# Altium schematic sheet Power.SchDoc
size A4; SheetNumber: 4; SheetTotal: 9
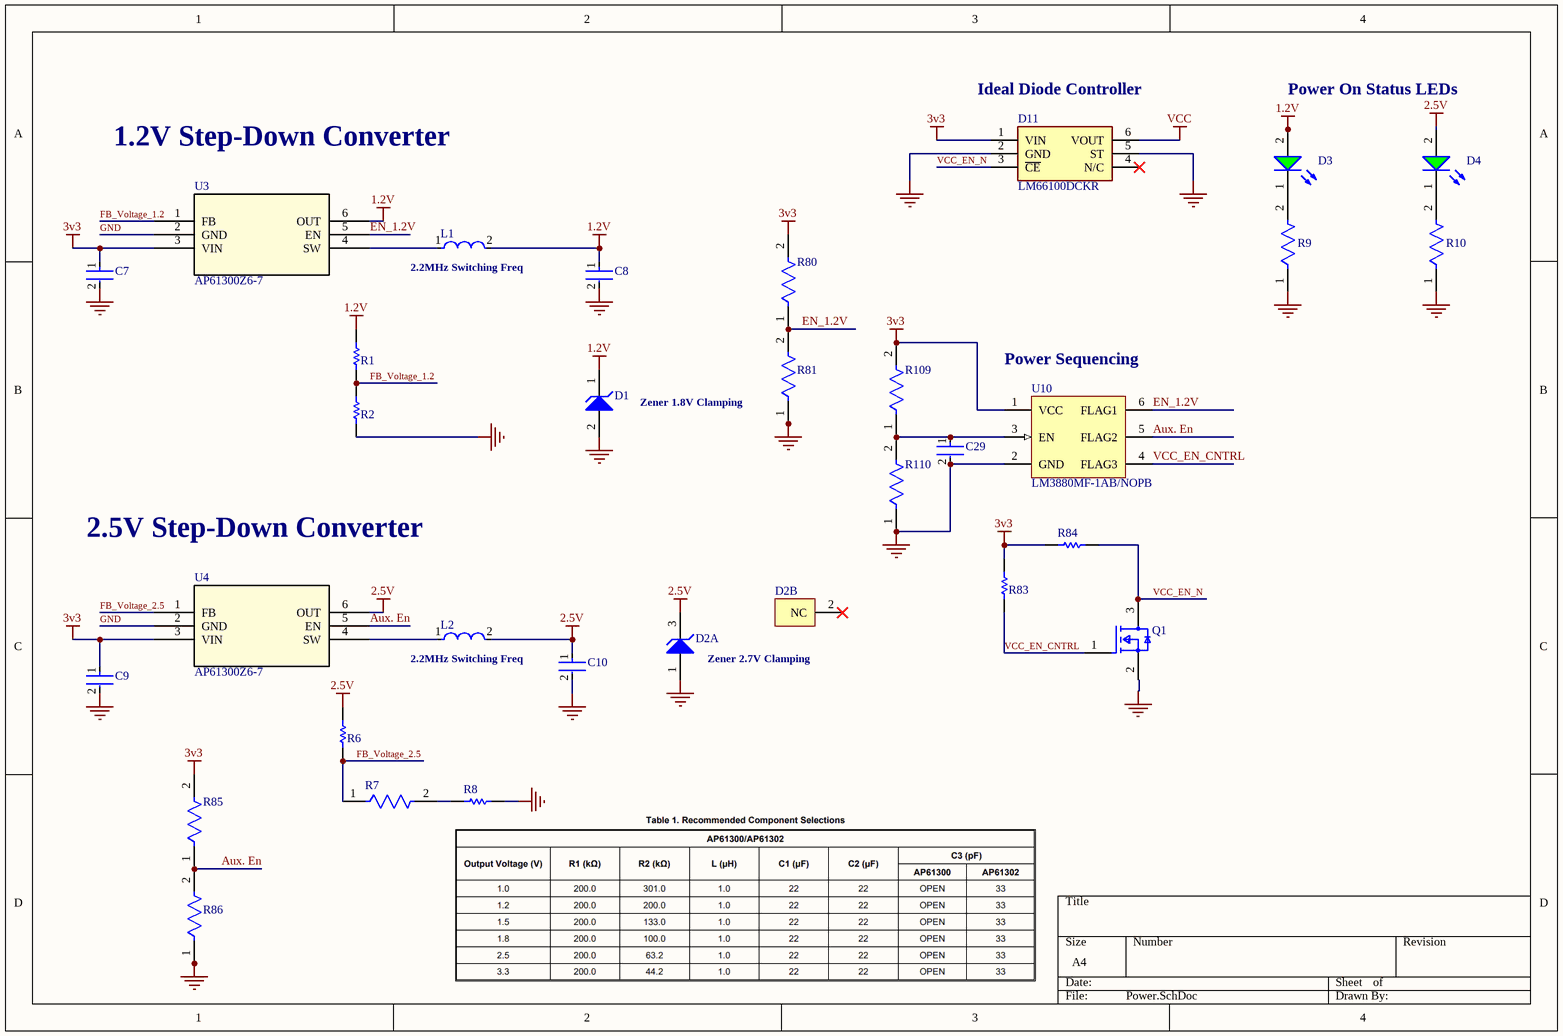
[diagram p0: Power.SchDoc]

## Parts
C7  GRT21BR61E226ME13L  [FP-GRT21B-0_2-IPC_C]  (value not drawn)
C8  GRT21BR61E226ME13L  [FP-GRT21B-0_2-IPC_C]  (value not drawn)
C9  GRT21BR61E226ME13L  [FP-GRT21B-0_2-IPC_C]  (value not drawn)
C10  GRT21BR61E226ME13L  [FP-GRT21B-0_2-IPC_C]  (value not drawn)
C29  CC0402KRX7R7BB104  [FP-CC0402-MFG]  (value not drawn)
D1  SZMMSZ4678T1G  [ONSC-SOD-123-2-425-04_V]  (value not drawn)
D2  MMBZ5223BLT1G  [ONSC-SOT-23-3-318-08_V]  (value not drawn)  (parts A,B of 2)
D3  150060VS75000  [WL-SMCW_0603_150060xx75000]  (value not drawn)
D4  150060VS75000  [WL-SMCW_0603_150060xx75000]  (value not drawn)
D11  LM66100DCKR  [SOP65P210X110-6N]
L1  MLP2012H2R2MT0S1  [FP-MLP2012M-IPC_C]  (value not drawn)
L2  MLP2012H2R2MT0S1  [FP-MLP2012M-IPC_C]  (value not drawn)
Q1  MMBF170LT1G  [FP-318-08-IPC_B]  (value not drawn)
R1  ERJ-2RKF2003X  [RESC1005X40X25NL05T05]  (value not drawn)
R2  RC0402FR-07100KL  [RESC1005X40X25NL05T10]  (value not drawn)
R6  ERJ-2RKF2003X  [RESC1005X40X25NL05T05]  (value not drawn)
R7  RT0603BRD0750KL  [FP-RT0603-0_55-MFG]  (value not drawn)
R8  RC0603FR-0713KL  [RESC1608X55X25LL10T15]  (value not drawn)
R9  RC0603FR-0710KL  [FP-RC0603-0_55-IPC_C]  (value not drawn)
R10  RC0603FR-0710KL  [FP-RC0603-0_55-IPC_C]  (value not drawn)
R80  RC0603FR-07100KL  [FP-RC0603-0_55-MFG]  (value not drawn)
R81  RT0805BRD07200KL  [FP-RT0805-MFG]  (value not drawn)
R83  RC0402FR-0710KL  [RESC1005X40X25LL05T10]  (value not drawn)
R84  RC0402FR-0710KL  [RESC1005X40X25LL05T10]  (value not drawn)
R85  RC0603FR-07100KL  [FP-RC0603-0_55-MFG]  (value not drawn)
R86  RT0805BRD07200KL  [FP-RT0805-MFG]  (value not drawn)
R109  RC0603FR-07100KL  [FP-RC0603-0_55-MFG]  (value not drawn)
R110  RC0603FR-07100KL  [FP-RC0603-0_55-MFG]  (value not drawn)
U3  AP61300Z6-7  [AP61300Z6-7_DIO]
U4  AP61300Z6-7  [AP61300Z6-7_DIO]
U10  LM3880MF-1AB/NOPB  [DBV0006A_M]

## Nets
1.2V: C8.1 D1.1(K) D3.2(A) L1.2 R1.1 U3.6(OUT)
2.5V: C10.1 D2.3(K) D4.2(A) L2.2 R6.1 U4.6(OUT)
3v3: C7.1 C9.1 D11.1(VIN) R80.2 R83.2 R84.1 R85.2 R109.2 U3.3(VIN) U4.3(VIN) U10.1(VCC)
GND: C7.2 C8.2 C9.2 C10.2 C29.2 D1.2(A) D2.1(A) D11.2(GND) D11.5(ST) R2.2 R8.2 R9.1 R10.1 R81.1 R86.1 R110.1 U3.2(GND) U4.2(GND) U10.2(GND)
VCC: D11.6(VOUT)
Aux. En: R85.1 R86.2 U4.5(EN) U10.5(FLAG2)
EN_1.2V: R80.1 R81.2 U3.5(EN) U10.6(FLAG1)
FB_Voltage_1.2: R1.2 R2.1 U3.1(FB)
FB_Voltage_2.5: R6.2 R7.1 U4.1(FB)
VCC_EN_CNTRL: Q1.1(G) R83.1 U10.4(FLAG3)
VCC_EN_N: D11.3(~{CE}) Q1.3(D) R84.2
NetC29_1: C29.1 R109.1 R110.2 U10.3(EN)
NetD3_1: D3.1(K) R9.2
NetD4_1: D4.1(K) R10.2
NetL1_1: L1.1 U3.4(SW)
NetL2_1: L2.1 U4.4(SW)
NetR7_2: R7.2 R8.1

Not connected (* = marked no-connect by the designer): D2 2(NC)*; D11 4(N/C)*; Q1 2(S)

## Notes on the sheet
- (near D11) Ideal Diode Controller
- Power On Status LEDs
- 1.2V Step-Down Converter
- (near L1) 2.2MHz Switching Freq
- (near U10) Power Sequencing
- Zener 1.8V Clamping
- 2.5V Step-Down Converter
- (near L2) 2.2MHz Switching Freq
- (near D2) Zener 2.7V Clamping

## Library data of the parts
C7-C10 = CMP-06035-011672-1: Multi-Layer Ceramic Capacitor 22uF 25V X5R ±20% 0805 Emboss T/R; Mount: Surface Mount; Case/Package: 0805; Min Operating Temperature: -55°C; Thickness: 0.057inch; Max Operating Temperature: 85°C; Case Code (Imperial): 0805; Voltage Rating: 25V; Length: 0.079inch; Ratings: AEC-Q200; Case Code (Metric): 2012; Capacitance: 22uF; Width: 0.049inch; Packaging: Tape and Reel; Tolerance: 20%
C29 = CMP-03422-000048-1: CAP CER 0.1UF 16V X7R 0402; Manufacturer: YAGEO; Material: Ceramic; Automotive Grade: NA; Capacitance: 100 nF; Temperature Coefficient: 30ppm/°C; Tolerance: 0.1; Value: 100 nF; Device Class L1: Passive Components; Temperature Range Low: -55°C; Device Class L3: Ceramic Capacitors; Temperature Characteristic: X7R; Ipc Land Pattern Name: CAPC10050X50; Temperature Range High: +125°C; Voltage Rating: 16 V; Temperature: -55°C to +125°C; RoHS: TRUE; Automotive: No; Height: 0.55mm; Device Class L2: Capacitors; Digikey Description: CAP CER 0.1UF 16V X7R 0402; Package: CC0402; Footprint Url: http://www.yageo.com/exep/pages/download/literatures/UPY-C_GEN_24.pdf; ComponentLink2Description: Datasheet; Category: Cap; Lead Free: Yes; Octopart: https://octopart.com/cc0402krx7r7bb104-yageo-42244624; ComponentLink2URL: http://www.yageo.com/documents/recent/UPY-GP_NP0_16V-to-50V_16.pdf; Manufacturer Part Number: CC0402KRX7R7BB104; Mouser Description: 0402 0.1 uF 16 V ±10 % Tolerance X7R SMT Multilayer Ceramic Capacitor
D1 = CMP-1060-00510-1: Zener Voltage Regulator, 500 mW, 2-Pin SOD-123, Pb-Free, Tape and Reel; Manufacturer: On Semiconductor; VZ Typ (V): 1.8; P Max (W): 0.5; PartNumber: SZMMSZ4678T1G; PackageDescription: 2-Pin SOD, Body 1.6 x 2.69 mm; Mounting Technology: Surface Mount; ComponentLink2URL: http://www.onsemi.com/pub_link/Collateral/MMSZ4678T1-D.PDF; ComponentLink1URL: http://www.onsemi.com/; DatasheetVersion: Rev. 9; PackageVersion: Rev. G, 10/2009; ComponentLink3Description: Package Specification; ComponentLink2Description: Datasheet; Packing: Tape and Reel; ComponentLink3URL: http://www.onsemi.com/pub_link/Collateral/425-04.PDF; RoHS: Pb-Free; PackageReference: SOD-123-2-425-04; ComponentLink1Description: Manufacturer URL
D2 = CMP-1060-01004-1: Zener Voltage Regulator, 225 mW, 3-Pin SOT-23, Pb-Free, Tape and Reel; Manufacturer: On Semiconductor; VZ Typ (V): 2.7; DatasheetVersion: Rev. 12; ComponentLink2Description: Datasheet; PackageVersion: Rev. AP, 11/2009; RoHS: Pb-Free; Packing: Tape and Reel; PackageReference: SOT-23-3-318-08; PackageDescription: 3-Pin Small Outline Transistor, Body 2.92 x 1.3 mm, Pitch 0.95 mm; ComponentLink1URL: http://www.onsemi.com/; ComponentLink3Description: Package Specification; ComponentLink2URL: http://www.onsemi.cn/pub_link/Collateral/MMBZ5221BLT1-D.PDF; PartNumber: MMBZ5223BLT1G; Mounting Technology: Surface Mount; ComponentLink1Description: Manufacturer URL; ComponentLink3URL: http://www.onsemi.cn/pub_link/Collateral/318-08.PDF
D3 D4 = CMP-1426-00006-7: WURTH ELEKTRONIK - 150060VS75000 - LED, Green, SMD, 0603, 30 mA, 2 V, 570 nm; Reverse Voltage: 5V; Power Dissipation: 72mW; Dominant Wavelength: 570nm; Peak Wavelength: 572nm; Forward Current: 100mA; Forward Voltage: 2V; Lens Style: Clear, Rectangular; Test Current: 20mA; Max Junction Temperature (Tj): 95°C; Viewing Angle: 140°; Luminous Intensity: 40mcd; Height: 700µm; Width: 800µm; Length: 1.6mm; Mount: Surface Mount; Min Operating Temperature: -40°C; Max Reverse Voltage (DC): 5V; Case Code (Imperial): 0603; Wavelength: 570nm; Color: Green; REACH SVHC: Unknown; RoHS: Compliant; Max Operating Temperature: 85°C; Packaging: Tape and Reel; Case/Package: 0603; Number of Pins: 2; Case Code (Metric): 1608
D11 = LM66100DCKR: Diode; Manufacturer_Name: Texas Instruments; Datasheet Link: http://www.ti.com/lit/gpn/LM66100; Height: 1.1mm; Manufacturer_Part_Number: LM66100DCKR; Mouser Part Number: 595-LM66100DCKR; Mouser Price/Stock: https://www.mouser.co.uk/ProductDetail/Texas-Instruments/LM66100DCKR?qs=vLWxofP3U2y2yPPrXoBBoA%3D%3D; Arrow Part Number: LM66100DCKR; Arrow Price/Stock: https://www.arrow.com/en/products/lm66100dckr/texas-instruments?region=nac
L1 L2 = CMP-08253-000154-1: Shielded Multilayer Inductor 2.2uH ±20% 1000mA 195mΩ SMD 0805; DC Resistance (DCR): 195mR; Core Material: Ferrite; Test Frequency: 2MHz; Current Rating: 1A; Packaging: Tape and Reel; Length: 0.079inch; Tolerance: 20%; Case/Package: 0805; Case Code (Imperial): 0805; Min Operating Temperature: -40°C; Inductance: 2.2uH; Case Code (Metric): 2012; Shielding: Shielded; Mount: Surface Mount; Lead Free: Lead Free; Height - Seated (Max): 0.039inch; Max Operating Temperature: 125°C; RoHS Compliant: Yes; Package Quantity: 4000; Width: 0.049inch
Q1 = CMP-1058-00793-2: MOSFET N-CH 60V 500MA SOT-23; Polarization: N; Rds On Max: 5R; Power Dissipation: 225mW; Number of Elements: 1; Element Configuration: Single; Input Capacitance: 60pF; Threshold Voltage: 3V; Polarity: N-CHANNEL; Gate to Source Voltage (Vgs): 20V; Turn-Off Delay Time: 10ns; Drain to Source Breakdown Voltage: 60V; On-State Resistance: 5R; Width: 1.3mm; Voltage Rating (DC): 60V; Package Quantity: 3000; Max Operating Temperature: 150°C; Drain to Source Resistance: 5R; Drain-source On Resistance-Max: 5R; Packaging: Tape and Reel; REACH SVHC: No SVHC; Case/Package: SOT-23-3; Number of Pins: 3; RoHS Compliant: Yes; Radiation Hardening: No; Min Operating Temperature: -55°C; Continuous Drain Current (ID): 500mA; Lead Free: Lead Free; Height: 0.94mm; Current Rating: 500mA; Turn-On Delay Time: 10ns; Series: -; Max Power Dissipation: 225mW; Length: 2.9mm; Nominal Vgs: 3V
R1 R6 = CMP-1011-00768-4: Chip Resistor, 200 KOhm, +/- 1%, 100 mW, -55 to 155 degC, 0402 (1005 Metric), RoHS, Tape and Reel; Manufacturer: Basic Passives; Case\/Package: 0402; Voltage Rating: 50 V; Power Rating: 100 mW; RoHSCompliant: true; Length: 1 mm; DatasheetVersion: 04/2015; ComponentLink2URL: http://industrial.panasonic.com/cdbs/www-data/pdf/RDA0000/AOA0000C86.pdf; Mount: Surface Mount; PackageDescription: 2-Pin Surface Mount Device, Body 1 x 0.5 mm; PartNumber: ERJ-2RKF2003X; Tolerance: 1%; Width: 0.5 mm; ComponentLink2Description: Datasheet; Packaging: Tape and Reel; REACH SVHC: No SVHC; Min Operating Temperature: -55 degC; Package Quantity: 10000; ComponentLink1Description: Manufacturer URL; Height: 0.35 mm; ComponentLink1URL: http://www.panasonic.com/; Mounting Technology: Surface Mount; Case Code (Imperial): 0402; PackageReference: 0402; Radiation Hardening: No; Pins: 2; Max Operating Temperature: 155 degC; Resistance: 200 KOhm; Case Code (Metric): 1005
R2 = CMP-2002-07343-1: Manufacturer: Yageo / Phycomp; Part Number: RC0402FR-07100KL
R7 = CMP-03412-048226-1: RES 50K OHM 0.1% 1/10W 0603
R8 = CMP-2000-06927-1: Chip Resistor, 13 KOhm, +/- 1%, 0.1 W, -55 to 155 degC, 0603 (1608 Metric), RoHS, Tape and Reel; Manufacturer: Yageo; Resistance: 13kOhms; Temperature Coefficient: 100PPM/C; Voltage Rating: 50V; Power Rating: 100mW; Packaging: Reel; Case Code - mm: 1608; Manufacturer URL: http://www.yageo.com/; Tolerance: 1%; Product: ThickFilmResistorsGeneralPurpose; Datasheet URL: http://www.yageo.com/documents/recent/PYu-RC_Group_51_RoHS_L_7.pdf; Package Reference: 0603; Operating Temperature Range: -55Cto+155C; Package Description: 2-Pin Surface Mount Device, Body 1.6 x 0.8 mm; Termination Style: SMD/SMT; Series: RC; Case Code - in: 0603; Datasheet Version: Rev. 7, 05/2017; Mounting Technology: SurfaceMount
R9 R10 = CMP-2100-03664-2: RES 10K OHM 1% 1/10W 0603; Voltage Rating: 75V; Voltage Rating (DC): 50V; Resistance: 10kR; Power Rating: 100mW; Temperature Coefficient: 100ppm/°C; Depth: 0.8mm; Termination: SMD/SMT; Resistor Type: Thick Film; Series: RC; Construction: Rectangular; Features: Moisture Resistant; Packaging: Tape and Reel; Min Operating Temperature: -55°C; Number of Terminations: 2; Lead Pitch: 0.3mm; RoHS Compliant: Yes; Case/Package: 0603; Resistance Tolerance: 1%; Military Standard: Not; Weight: 7.1E-05oz; Number of Pins: 2; Tolerance: 1%; Length: 1.6mm; Case Code (Imperial): 0603; Lead Free: Lead Free; Width: 0.8mm; Max Power Dissipation: 100mW; Height: 0.45mm; Max Operating Temperature: 155°C; Case Code (Metric): 1608; Size Code: 0603
R80 R85 R109 R110 = CMP-2100-03662-2: RES SMD 100K OHM 1% 1/10W 0603; Voltage Rating (DC): 50V; Resistance: 100kR; Max Power Dissipation: 100mW; Temperature Coefficient: 100ppm/°C; Working Voltage: 75V; Length: 1.6mm; Lead Free: Lead Free; Number of Terminations: 2; Packaging: Tape and Reel; Voltage Rating: 50V; Termination: SMD/SMT; Width: 0.8mm; Resistor Type: Thick Film; Resistance Tolerance: 1%; Features: Moisture Resistant; Height: 0.45mm; Construction: Rectangular; Case/Package: 0603; Military Standard: Not; Case Code (Imperial): 0603; Series: RC; Technology: THICK FILM; Depth: 0.8mm; RoHS Compliant: Yes; REACH SVHC: No SVHC; Min Operating Temperature: -55°C; Case Code (Metric): 1608; Max Operating Temperature: 155°C; Power Rating: 100mW; Number of Pins: 2; Tolerance: 1%
R81 R86 = CMP-2001-01722-2: RES SMD 200K OHM 0.1% 1/8W 0805; Manufacturer: Yageo; Voltage Rating: 150V; Resistance: 200KΩ; Power Rating: 0.125W; Value: 200KΩ; Tolerance: 0.0025; Temperature Coefficient: 25 ppm/°C; Automotive: No; Manufacturer Part Number: RT0805BRD07200KL; Package: RT0805; RoHS: TRUE; Ipc Land Pattern Name: RESC200125X50; Series: RT; Height: 0.6mm; Device Class L1: Passive Components; Footprint Url: http://www.yageo.com/exep/pages/download/literatures/PYu-R_Mount_10.pdf; Mouser Description: High Precision-High Stability Chip Resistor Thin Film 0805 200kOhm 0.1% Paper T/R; Composition: Thin Film; Temperature: -55°C to +155°C; Device Class L3: Chip SMD Resistors; Temperature Range Low: -55°C; Octopart: https://octopart.com/rt0805brd07200kl-yageo-1477199; Device Class L2: Resistors; Temperature Range High: +155°C; ComponentLink2Description: Datasheet; Category: Res; Lead Free: Yes; ComponentLink2URL: http://www.yageo.com/documents/recent/PYu-RT_1-to-0.01_RoHS_L_9.pdf; Digikey Description: RES SMD 200K OHM 0.1% 1/8W 0805
R83 R84 = CMP-2002-07353-1: Manufacturer: Yageo / Phycomp; Part Number: RC0402FR-0710KL
U3 U4 = AP61300Z6-7: No Description Available; Manufacturer_Name: Diodes Inc; Copyright: Copyright (C) 2025 Ultra Librarian. All rights reserved.; Manufacturer_Part_Number: AP61300Z6-7; RefDes: RefDes; Type: Type
U10 = CMP-0063-01011-4: Power Sequencer, 6-pin SOT-23, Pb-Free, 1000 Reel; Manufacturer: Texas Instruments; High-Reliability: Y; CompType: MiscPower; PowerWise: N; PackageTopMarking: F21A*XTT; Code_JEDEC: MO-178-AB; PartNumber: LM3880MF-1AB/NOPB; RoHS: Y; PackageReference: DBV0006A; ComponentLink1Description: Datasheet URL; Code_IPC: SOT26A-6; PinCount: 6; PackageDescription: Molded SOT-23, .115 x .063 x .040in Body, 6 Lead, .0375in in Pitch; ComponentLink1URL: http://www.ti.com/general/docs/lit/getliterature.tsp?genericPartNumber=LM3880&fileType=pdf